# EAGLE schematic Clock Schematic v.4 (EAGLE 9.3.0)
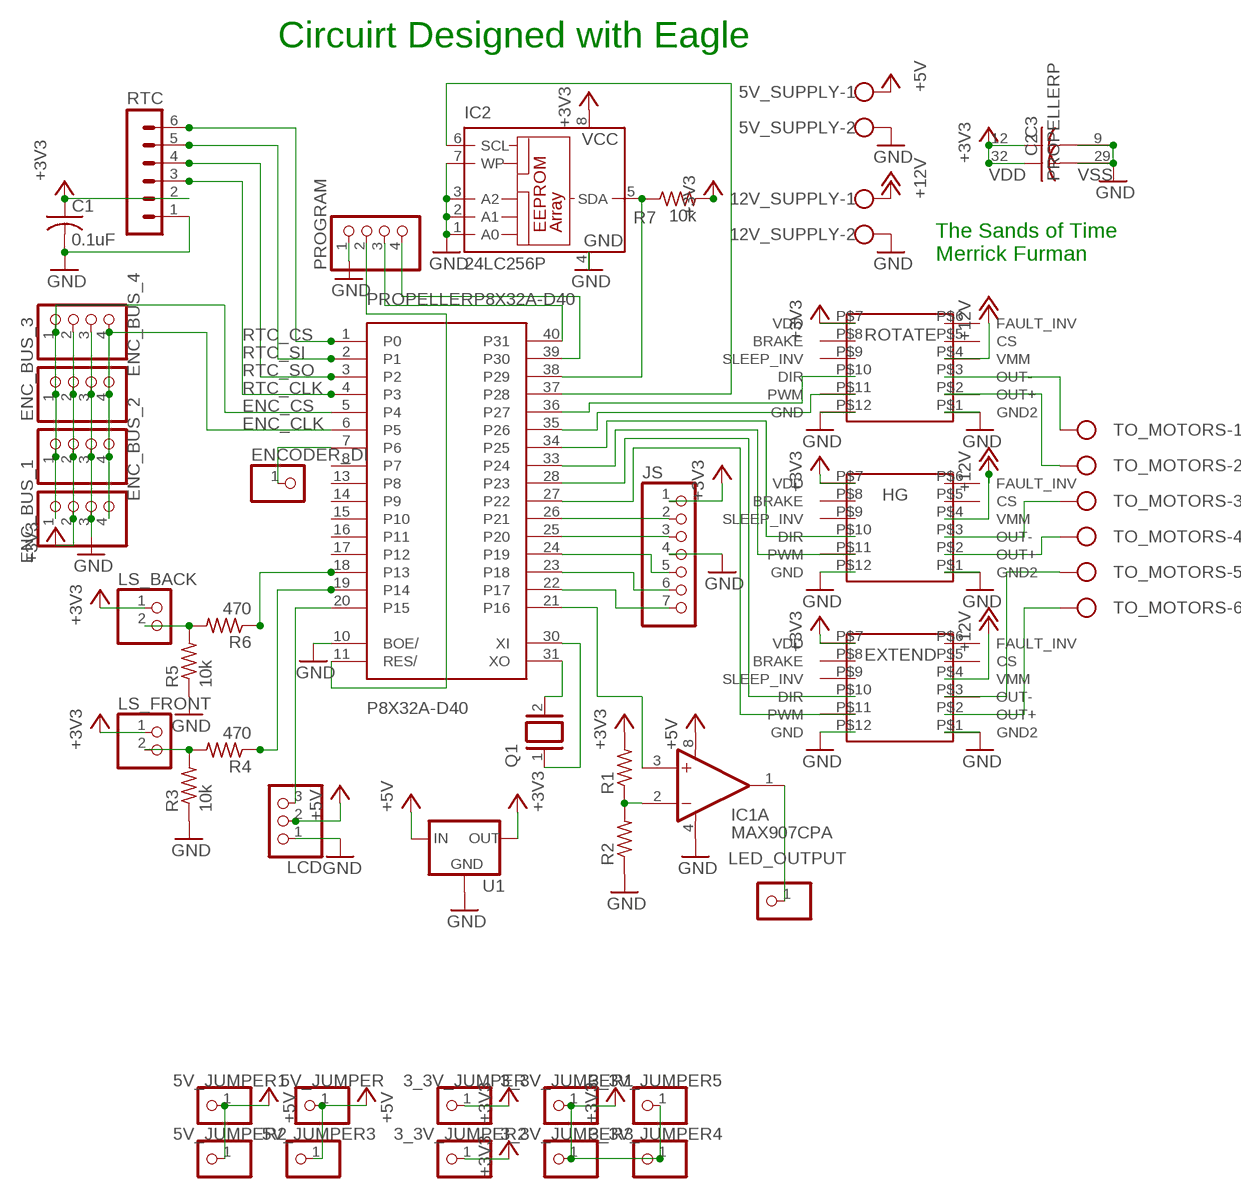
[diagram p0: schematic, sheet 1]

## Parts
3_3V_JUMPER  PINHD-1X1  [1X01]
3_3V_JUMPER1  PINHD-1X1  [1X01]
3_3V_JUMPER2  PINHD-1X1  [1X01]
3_3V_JUMPER3  PINHD-1X1  [1X01]
3_3V_JUMPER4  PINHD-1X1  [1X01]
3_3V_JUMPER5  PINHD-1X1  [1X01]
5V_JUMPER  PINHD-1X1  [1X01]
5V_JUMPER1  PINHD-1X1  [1X01]
5V_JUMPER2  PINHD-1X1  [1X01]
5V_JUMPER3  PINHD-1X1  [1X01]
5V_SUPPLY  W237-102  [W237-102]
12V_SUPPLY  W237-102  [W237-102]
C1  0.1uF  C-US050-025X075  [C050-025X075]
C2  C-US050-025X075  [C050-025X075]
C3  C-US050-025X075  [C050-025X075]
ENC_BUS_1  PINHD-1X4  [1X04]
ENC_BUS_2  PINHD-1X4  [1X04]
ENC_BUS_3  PINHD-1X4  [1X04]
ENC_BUS_4  PINHD-1X4  [1X04]
ENCODER_DI  PINHD-1X1  [1X01]
EXTEND  DRV  [DRV]
HG  DRV  [DRV]
IC1  MAX907CPA  [DIL08]
IC2  24LC256P  [DIL8]
JS  PINHD-1X7  [1X07]
LCD  PINHD-1X3  [1X03]
LED_OUTPUT  PINHD-1X1  [1X01]
LS_BACK  PINHD-1X2  [1X02]
LS_FRONT  PINHD-1X2  [1X02]
PROGRAM  PINHD-1X4  [1X04]
PROPELLER  P8X32A-D40  [P8X32A-D40]
Q1  XTAL/S  [QS]
R1  R-US_0207/10  [0207/10]
R2  R-US_0207/10  [0207/10]
R3  10k  R-US_0207/10  [0207/10]
R4  470  R-US_0207/10  [0207/10]
R5  10k  R-US_0207/10  [0207/10]
R6  470  R-US_0207/10  [0207/10]
R7  10k  R-US_0207/10  [0207/10]
ROTATE  DRV  [DRV]
RTC  MA06-1  [MA06-1]
TO_MOTORS  W237-6  [W237-6]
U1  V_REG_78XXSIDE  [78XXL]

## Nets
+3V3: 3_3V_JUMPER1.1 3_3V_JUMPER2.1 3_3V_JUMPER3.1 3_3V_JUMPER4.1 3_3V_JUMPER5.1 3_3V_JUMPER.1 C1.1 C2.1 C3.1 ENC_BUS_1.2 ENC_BUS_2.2 ENC_BUS_3.2 ENC_BUS_4.2 EXTEND.P$7(VDD) HG.P$7(VDD) IC2.8(VCC) JS.1 LS_BACK.1 LS_FRONT.1 PROPELLER.12(P:VDD) PROPELLER.32(P:VDD) R1.2 R7.2 ROTATE.P$7(VDD) RTC.2 U1.OUT
+5V: 5V_JUMPER1.1 5V_JUMPER2.1 5V_JUMPER3.1 5V_JUMPER.1 5V_SUPPLY.1 IC1.8(A:V+) LCD.2 U1.IN
+12V: 12V_SUPPLY.1 EXTEND.P$4(VMM) HG.P$4(VMM) ROTATE.P$4(VMM)
ENC_CLK: ENC_BUS_1.4 ENC_BUS_2.4 ENC_BUS_3.4 ENC_BUS_4.4 PROPELLER.6(P8X32A-D40:P5)
ENC_CS: ENC_BUS_1.1 ENC_BUS_2.1 ENC_BUS_3.1 ENC_BUS_4.1 PROPELLER.5(P8X32A-D40:P4)
GND: 5V_SUPPLY.2 12V_SUPPLY.2 C1.2 C2.2 C3.2 ENC_BUS_1.3 ENC_BUS_2.3 ENC_BUS_3.3 ENC_BUS_4.3 EXTEND.P$1(GND2) EXTEND.P$12(GND) HG.P$1(GND2) HG.P$12(GND) IC1.4(A:V-) IC2.1(A0) IC2.2(A1) IC2.3(A2) IC2.4(GND) IC2.7(WP) JS.4 LCD.1 PROGRAM.1 PROPELLER.9(P:VSS) PROPELLER.10(P8X32A-D40:BOE/) PROPELLER.29(P:VSS) R2.1 R3.1 R5.1 ROTATE.P$1(GND2) ROTATE.P$12(GND) RTC.1 U1.GND
N$1: ENCODER_DI.1 PROPELLER.7(P8X32A-D40:P6)
N$2: JS.5 PROPELLER.24(P8X32A-D40:P19)
N$3: JS.6 PROPELLER.23(P8X32A-D40:P18)
N$4: JS.7 PROPELLER.22(P8X32A-D40:P17)
N$5: JS.3 PROPELLER.25(P8X32A-D40:P20)
N$6: JS.2 PROPELLER.26(P8X32A-D40:P21)
N$7: LCD.3 PROPELLER.20(P8X32A-D40:P15)
N$9: IC1.1(A:OUT) LED_OUTPUT.1
N$10: PROPELLER.31(P8X32A-D40:XO) Q1.2
N$11: IC1.2(A:-IN) R1.1 R2.2
N$12: PROPELLER.30(P8X32A-D40:XI) Q1.1
N$13: PROPELLER.19(P8X32A-D40:P14) R4.1
N$14: LS_BACK.2 R5.2 R6.2
N$15: PROPELLER.18(P8X32A-D40:P13) R6.1
N$16: IC2.6(SCL) PROPELLER.37(P8X32A-D40:P28)
N$17: EXTEND.P$11(PWM) PROPELLER.27(P8X32A-D40:P22)
N$18: PROGRAM.4 PROPELLER.39(P8X32A-D40:P30)
N$19: PROGRAM.3 PROPELLER.40(P8X32A-D40:P31)
N$20: IC2.5(SDA) PROPELLER.38(P8X32A-D40:P29) R7.1
N$21: IC1.3(A:+IN) PROPELLER.21(P8X32A-D40:P16)
N$22: EXTEND.P$10(DIR) PROPELLER.28(P8X32A-D40:P23)
N$23: HG.P$11(PWM) PROPELLER.33(P8X32A-D40:P24)
N$24: HG.P$10(DIR) PROPELLER.34(P8X32A-D40:P25)
N$25: PROPELLER.35(P8X32A-D40:P26) ROTATE.P$11(PWM)
N$26: PROGRAM.2 PROPELLER.11(P8X32A-D40:RES/)
N$27: LS_FRONT.2 R3.2 R4.2
N$28: PROPELLER.36(P8X32A-D40:P27) ROTATE.P$10(DIR)
N$29: ROTATE.P$3(OUT-) TO_MOTORS.1
N$30: ROTATE.P$2(OUT+) TO_MOTORS.2
N$31: HG.P$3(OUT-) TO_MOTORS.3
N$32: HG.P$2(OUT+) TO_MOTORS.4
N$33: EXTEND.P$3(OUT-) TO_MOTORS.5
N$34: EXTEND.P$2(OUT+) TO_MOTORS.6
RTC_CLK: PROPELLER.4(P8X32A-D40:P3) RTC.3
RTC_CS: PROPELLER.1(P8X32A-D40:P0) RTC.6
RTC_SI: PROPELLER.2(P8X32A-D40:P1) RTC.5
RTC_SO: PROPELLER.3(P8X32A-D40:P2) RTC.4
Unconnected: EXTEND.P$5(CS) EXTEND.P$6(FAULT_INV) EXTEND.P$8(BRAKE) EXTEND.P$9(SLEEP_INV) HG.P$5(CS) HG.P$6(FAULT_INV) HG.P$8(BRAKE) HG.P$9(SLEEP_INV) IC1.5(B:+IN) IC1.6(B:-IN) IC1.7(B:OUT) PROPELLER.8(P8X32A-D40:P7) PROPELLER.13(P8X32A-D40:P8) PROPELLER.14(P8X32A-D40:P9) PROPELLER.15(P8X32A-D40:P10) PROPELLER.16(P8X32A-D40:P11) PROPELLER.17(P8X32A-D40:P12) ROTATE.P$5(CS) ROTATE.P$6(FAULT_INV) ROTATE.P$8(BRAKE) ROTATE.P$9(SLEEP_INV)

## Notes on the sheet
- Circuirt Designed with Eagle
- The Sands of Time
  Merrick Furman

## Library data of the parts
3_3V_JUMPER 3_3V_JUMPER1-3_3V_JUMPER5 5V_JUMPER 5V_JUMPER1-5V_JUMPER3 ENCODER_DI LED_OUTPUT = pinhead:PINHD-1X1: PIN HEADER
5V_SUPPLY 12V_SUPPLY = con-wago-500:W237-102: WAGO SCREW CLAMP; MPN: 237-102; OC_FARNELL: unknown; OC_NEWARK: 70K9898
C1-C3 = rcl:C-US: CAPACITOR, American symbol; SPICEPREFIX: C
ENC_BUS_1-ENC_BUS_4 PROGRAM = pinhead:PINHD-1X4: PIN HEADER
EXTEND HG ROTATE = Pololu_DRV8801_Breakout:DRV
IC1 = maxim:MAX907CPA: COMPARATOR; MF: MAXIM; MPN: MAX907CPA; OC_FARNELL: unknown; OC_NEWARK: 79C3004
IC2 = microchip:24*: Serial EEPROM I2C; MF: MICROCHIP; MPN: 24LC256-E/P; OC_FARNELL: 9757970; OC_NEWARK: 92C7169
JS = pinhead:PINHD-1X7: PIN HEADER
LCD = pinhead:PINHD-1X3: PIN HEADER
LS_BACK LS_FRONT = pinhead:PINHD-1X2: PIN HEADER
PROPELLER = parallax_propeller:P8X32A-D40
Q1 = special:XTAL/S: CRYSTAL
R1-R7 = rcl:R-US_: RESISTOR, American symbol; SPICEPREFIX: R
RTC = con-lstb:MA06-1: PIN HEADER; OC_FARNELL: unknown; OC_NEWARK: unknown
TO_MOTORS = con-wago-500:W237-6: WAGO SCREW CLAMP; OC_FARNELL: unknown; OC_NEWARK: unknown
U1 = SparkFun-IC-Power:V_REG_78XX: Voltage Regulator Standard 78xx regulator. IGO (Input Ground Output). Spark Fun Electronics SKU : COM-00107